# Altium schematic sheet RESET_BOARD_VIA_ETHERNET.SchDoc
size A4; SheetNumber: 1; SheetTotal: 1
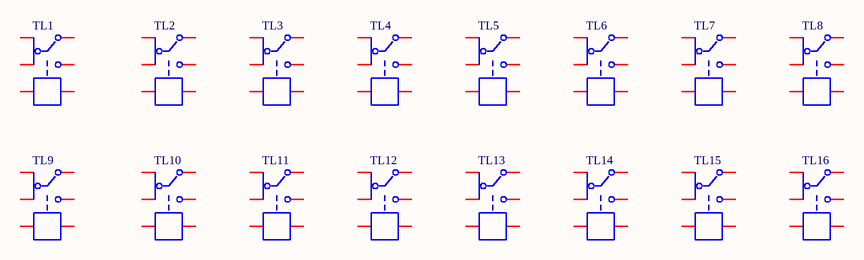
[diagram p0: RESET_BOARD_VIA_ETHERNET.SchDoc]

## Parts
TL1  HK4100F-DC3V-SHG  [RELAY-HK4100F-DC3V-SHG]  (value not drawn)
TL2  HK4100F-DC3V-SHG  [RELAY-HK4100F-DC3V-SHG]  (value not drawn)
TL3  HK4100F-DC3V-SHG  [RELAY-HK4100F-DC3V-SHG]  (value not drawn)
TL4  HK4100F-DC3V-SHG  [RELAY-HK4100F-DC3V-SHG]  (value not drawn)
TL5  HK4100F-DC3V-SHG  [RELAY-HK4100F-DC3V-SHG]  (value not drawn)
TL6  HK4100F-DC3V-SHG  [RELAY-HK4100F-DC3V-SHG]  (value not drawn)
TL7  HK4100F-DC3V-SHG  [RELAY-HK4100F-DC3V-SHG]  (value not drawn)
TL8  HK4100F-DC3V-SHG  [RELAY-HK4100F-DC3V-SHG]  (value not drawn)
TL9  HK4100F-DC3V-SHG  [RELAY-HK4100F-DC3V-SHG]  (value not drawn)
TL10  HK4100F-DC3V-SHG  [RELAY-HK4100F-DC3V-SHG]  (value not drawn)
TL11  HK4100F-DC3V-SHG  [RELAY-HK4100F-DC3V-SHG]  (value not drawn)
TL12  HK4100F-DC3V-SHG  [RELAY-HK4100F-DC3V-SHG]  (value not drawn)
TL13  HK4100F-DC3V-SHG  [RELAY-HK4100F-DC3V-SHG]  (value not drawn)
TL14  HK4100F-DC3V-SHG  [RELAY-HK4100F-DC3V-SHG]  (value not drawn)
TL15  HK4100F-DC3V-SHG  [RELAY-HK4100F-DC3V-SHG]  (value not drawn)
TL16  HK4100F-DC3V-SHG  [RELAY-HK4100F-DC3V-SHG]  (value not drawn)

## Nets

Not connected (* = marked no-connect by the designer): TL1 1 2 3 4 5 6; TL2 1 2 3 4 5 6; TL3 1 2 3 4 5 6; TL4 1 2 3 4 5 6; TL5 1 2 3 4 5 6; TL6 1 2 3 4 5 6; TL7 1 2 3 4 5 6; TL8 1 2 3 4 5 6; TL9 1 2 3 4 5 6; TL10 1 2 3 4 5 6; TL11 1 2 3 4 5 6; TL12 1 2 3 4 5 6; TL13 1 2 3 4 5 6; TL14 1 2 3 4 5 6; TL15 1 2 3 4 5 6; TL16 1 2 3 4 5 6

## Library data of the parts
TL1-TL16 = Relay-HK4100F-DC3V-SHG